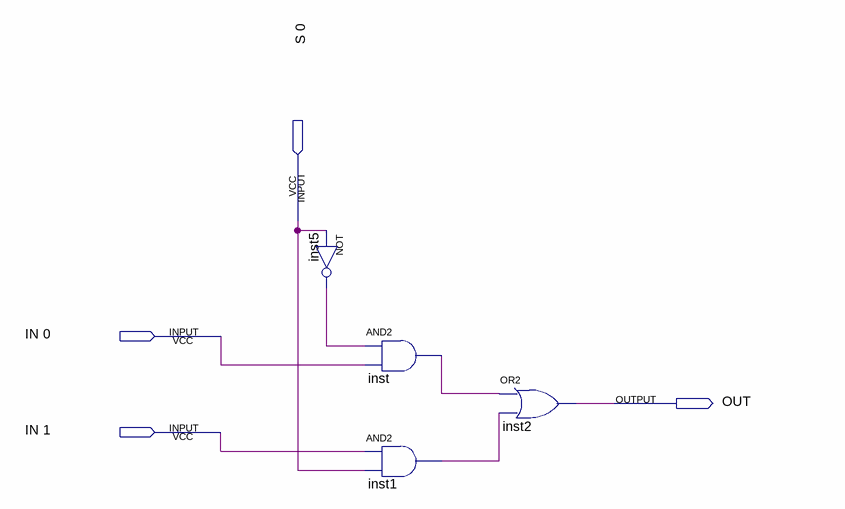
[diagram p0: schematic sheet]
// Quartus schematic 2_TO_1_MUX.bdf as structural Verilog: 4 symbols, 4 pins
module \2_TO_1_MUX  (
  input  \S_0 ,
  input  \IN_0 ,
  input  \IN_1 ,
  output OUT
);

  wire inst1_out, inst5_out, inst_out;

  not inst5 (inst5_out, \S_0 );
  and inst (inst_out, inst5_out, \IN_0 );
  and inst1 (inst1_out, \IN_1 , \S_0 );
  or inst2 (OUT, inst_out, inst1_out);
endmodule
